# Altium schematic sheet MC-311D_2025-02-05.schdoc
size 62 x 65 mm
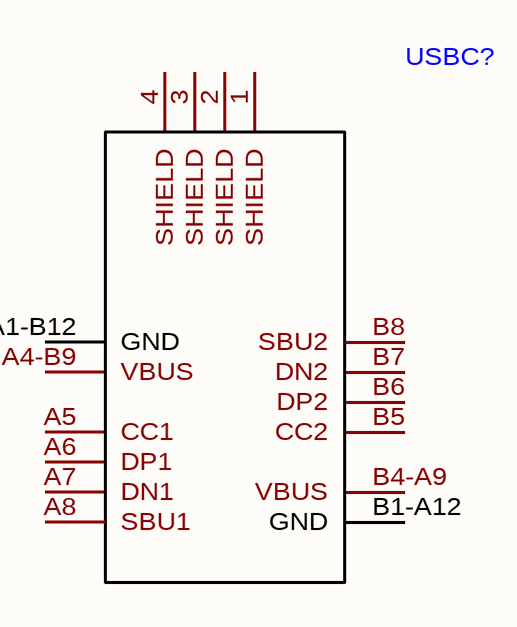
[diagram p0: MC-311D_2025-02-05.schdoc]

## Parts
USBC?  (no value)  [USB-C-SMD_MC-311D]

## Nets

Not connected (* = marked no-connect by the designer): USBC? 1(SHIELD) 2(SHIELD) 3(SHIELD) 4(SHIELD) A1-B12(GND) A4-B9(VBUS) A5(CC1) A6(DP1) A7(DN1) A8(SBU1) B1-A12(GND) B4-A9(VBUS) B5(CC2) B6(DP2) B7(DN2) B8(SBU2)

## Library data of the parts
USBC? = MC-311D